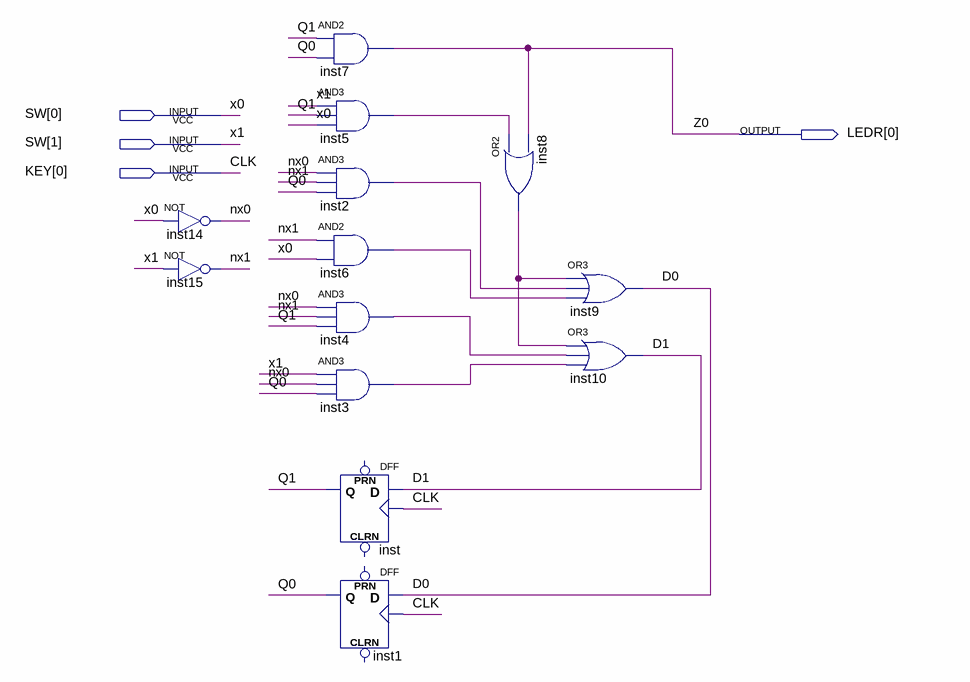
[diagram p0: schematic sheet]
// Quartus schematic proj2.bdf as structural Verilog: 13 symbols, 4 pins
module proj2 (
  input  [1:0] SW,
  input  [0:0] KEY,
  output [0:0] LEDR
);

  wire D0, D1, inst2_out, inst3_out, inst4_out, inst5_out, inst6_out, inst8_out, nx0, nx1, Q0, Q1;

  not inst14 (nx0, SW[0]);
  not inst15 (nx1, SW[1]);
  and inst7 (LEDR[0], Q1, Q0);
  and inst5 (inst5_out, SW[1], Q1, SW[0]);
  and inst2 (inst2_out, nx0, nx1, Q0);
  and inst6 (inst6_out, nx1, SW[0]);
  and inst4 (inst4_out, nx0, nx1, Q1);
  and inst3 (inst3_out, SW[1], nx0, Q0);
  DFF inst (.CLK(KEY[0]), .D(D1), .Q(Q1));  // open: CLRN, PRN
  DFF inst1 (.CLK(KEY[0]), .D(D0), .Q(Q0));  // open: CLRN, PRN
  or inst8 (inst8_out, inst5_out, LEDR[0]);
  or inst9 (D0, inst8_out, inst2_out, inst6_out);
  or inst10 (D1, inst8_out, inst4_out, inst3_out);

  // Other names for the same wires on the sheet: CLK = KEY[0]; x0 = SW[0]; x1 = SW[1]; Z0 = LEDR[0]
endmodule
